# Altium schematic sheet Scheme.SchDoc
size A4
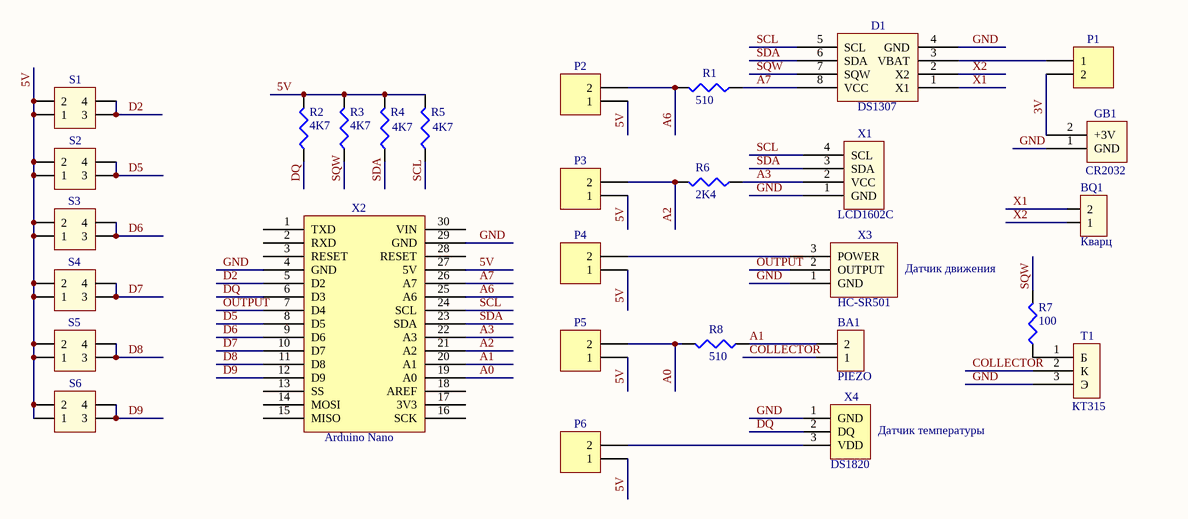
[diagram p0: Scheme.SchDoc]

## Parts
BA1  PIEZO  [Piezo Buzzer]
BQ1  DT-38  [DT-38]  (value not drawn)
D1  DS1307  [DS1307]
GB1  CR2032  [BAT CR2032 3V]
P1  Header 2  [HDR1X2]  (value not drawn)
P2  Header 2  [HDR1X2]  (value not drawn)
P3  Header 2  [HDR1X2]  (value not drawn)
P4  Header 2  [HDR1X2]  (value not drawn)
P5  Header 2  [HDR1X2]  (value not drawn)
P6  Header 2  [HDR1X2]  (value not drawn)
R1  510  [J1-0603]
R2  4K7  [J1-0603]
R3  4K7  [J1-0603]
R4  4K7  [J1-0603]
R5  4K7  [J1-0603]
R6  2K4  [J1-0603]
R7  100  [J1-0603]
R8  510  [J1-0603]
S1  12X12 mm BUTTON  [12X12mm BUTTON]  (value not drawn)
S2  12X12 mm BUTTON  [12X12mm BUTTON]  (value not drawn)
S3  12X12 mm BUTTON  [12X12mm BUTTON]  (value not drawn)
S4  12X12 mm BUTTON  [12X12mm BUTTON]  (value not drawn)
S5  12X12 mm BUTTON  [12X12mm BUTTON]  (value not drawn)
S6  12X12 mm BUTTON  [12X12mm BUTTON]  (value not drawn)
T1  КТ315  [KT315]
X1  LCD1602C  [LCD1602]
X2  Arduino Nano  [Arduino Nano]
X3  HC-SR501  [HC-SR501]
X4  DS1820  [DS1820]

## Nets
3V: GB1.2(+3V) P1.2
5V: P2.1 P3.1 P4.1 P5.1 P6.1 R2.2 R3.2 R4.2 R5.2 S1.1 S1.2 S2.1 S2.2 S3.1 S3.2 S4.1 S4.2 S5.1 S5.2 S6.1 S6.2 X2.27(5V)
A0: P5.2 R8.2 X2.19(A0)
A1: BA1.2 R8.1 X2.20(A1)
A2: P3.2 R6.2 X2.21(A2)
A3: R6.1 X1.2(VCC) X2.22(A3)
A6: P2.2 R1.2 X2.25(A6)
A7: D1.8(VCC) R1.1 X2.26(A7)
COLLECTOR: BA1.1 T1.2(К)
D2: S1.3 S1.4 X2.5(D2)
D5: S2.3 S2.4 X2.8(D5)
D6: S3.3 S3.4 X2.9(D6)
D7: S4.3 S4.4 X2.10(D7)
D8: S5.3 S5.4 X2.11(D8)
D9: S6.3 S6.4 X2.12(D9)
DQ: R2.1 X2.6(D3) X4.2(DQ)
GND: D1.4(GND) GB1.1(GND) T1.3(Э) X1.1(GND) X2.4(GND) X2.29(GND) X3.1(GND) X4.1(GND)
OUTPUT: X2.7(D4) X3.2(OUTPUT)
SCL: D1.5(SCL) R5.1 X1.4(SCL) X2.24(SCL)
SDA: D1.6(SDA) R4.1 X1.3(SDA) X2.23(SDA)
SQW: D1.7(SQW) R3.1 R7.2
X1: BQ1.2 D1.1(X1)
X2: BQ1.1 D1.2(X2)
NetD1_3: D1.3(VBAT) P1.1
NetP4_2: P4.2 X3.3(POWER)
NetP6_2: P6.2 X4.3(VDD)
NetR7_1: R7.1 T1.1(Б)

Not connected (* = marked no-connect by the designer): X2 1(TXD) 2(RXD) 3(RESET) 13(SS) 14(MOSI) 15(MISO) 16(SCK) 17(3V3) 18(AREF) 28(RESET) 30(VIN)

## Notes on the sheet
- (near BQ1) Кварц
- (near R7) Датчик движения
- (near X4) Датчик температуры

## Library data of the parts
GB1 = BAT CR2032 3V
P1-P6 = Header 2: Header, 2-Pin; LatestRevisionDate: 17-Jul-2002; LatestRevisionNote: Re-released for DXP Platform.; Publisher: Altium Limited
R1-R8 = Res3: Resistor; Value: 1K; Published: 8-Jun-2000; LatestRevisionDate: 29-May-2009; LatestRevisionNote: IPC-7351 Footprint Added.; PackageReference: J1-0603; Publisher: Altium Limited; PackageDescription: Chip Resistor
T1 = KT315